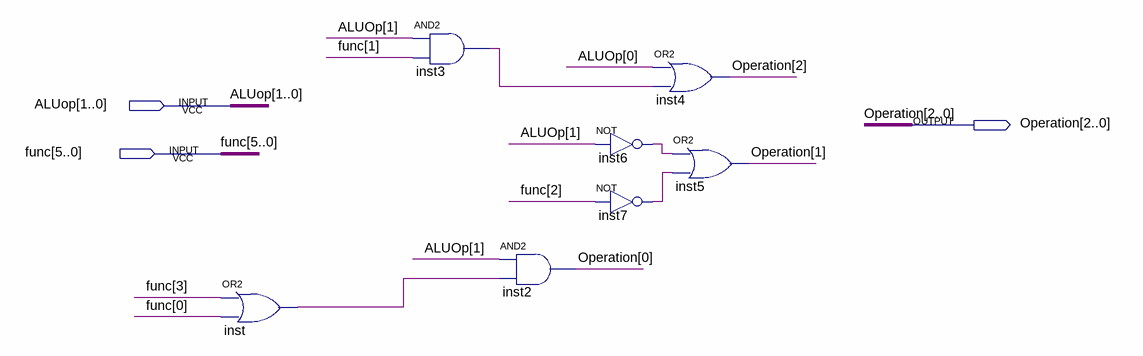
[diagram p0: schematic sheet]
// Quartus schematic ALUControl.bdf as structural Verilog: 7 symbols, 3 pins
module ALUControl (
  input  [1:0] ALUop,
  input  [5:0] func,
  output [2:0] Operation
);

  wire inst3_out, inst6_out, inst7_out, inst_out;

  or inst (inst_out, func[3], func[0]);
  and inst3 (inst3_out, ALUop[1], func[1]);
  and inst2 (Operation[0], ALUop[1], inst_out);
  or inst4 (Operation[2], ALUop[0], inst3_out);
  not inst6 (inst6_out, ALUop[1]);
  not inst7 (inst7_out, func[2]);
  or inst5 (Operation[1], inst6_out, inst7_out);
endmodule
